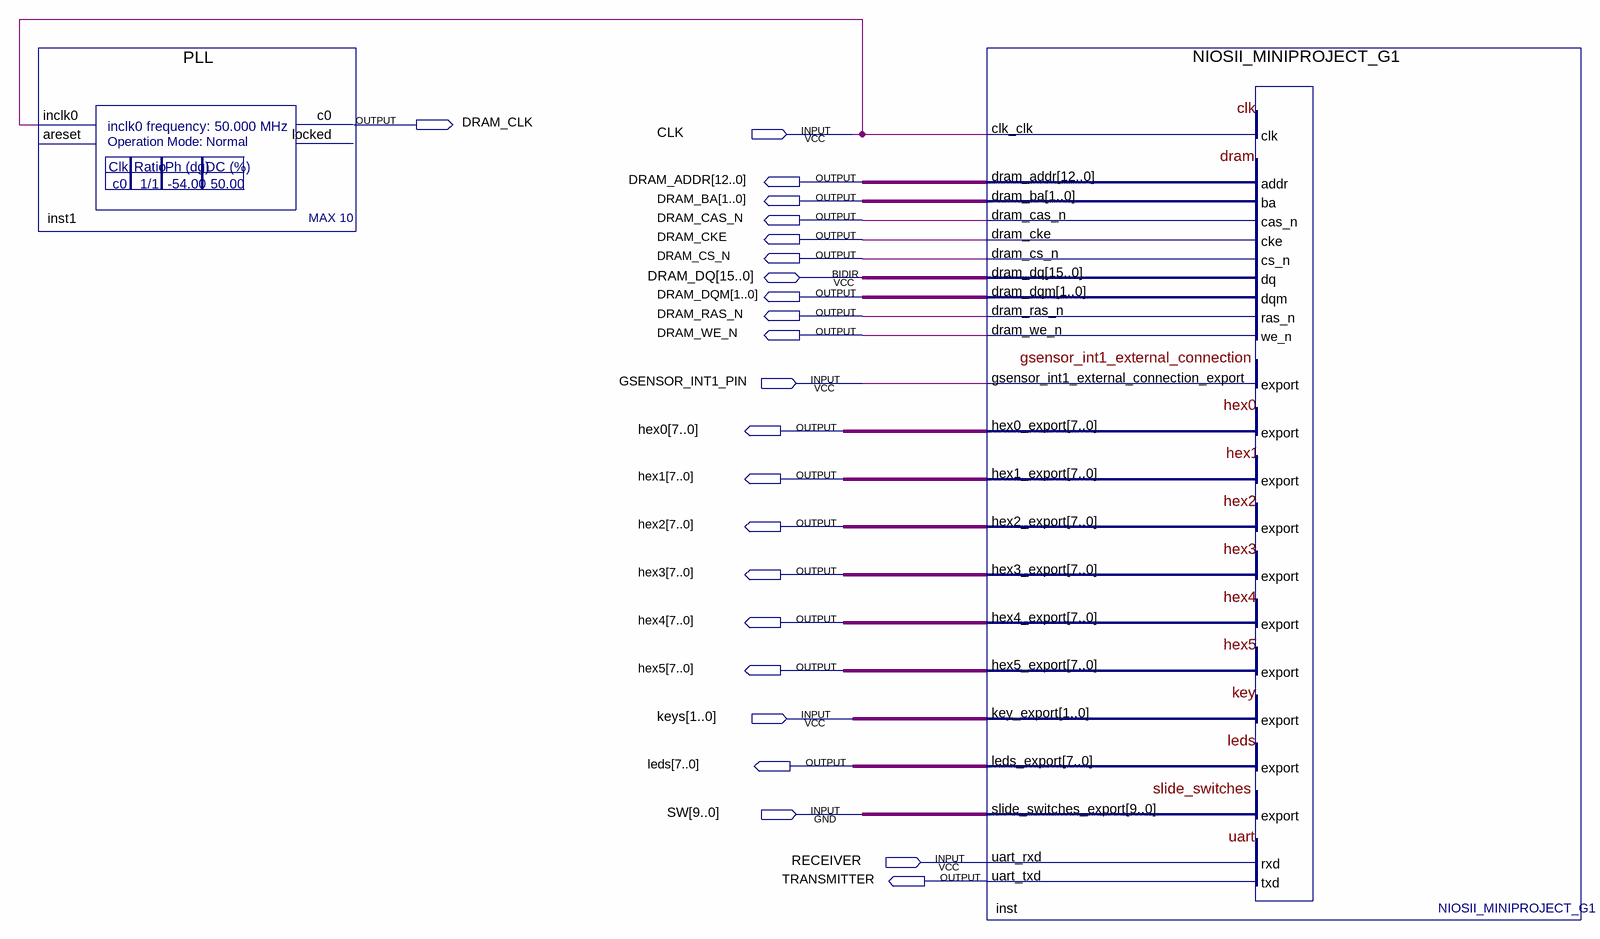
[diagram p0: schematic sheet]
// Quartus schematic ECE3073_MINIPROJECT_GROUP1.bdf as structural Verilog: 2 symbols, 23 pins
module ECE3073_MINIPROJECT_GROUP1 (
  input  CLK,
  input  GSENSOR_INT1_PIN,
  input  [1:0] keys,
  input  [9:0] SW,
  input  RECEIVER,
  inout  [15:0] DRAM_DQ,
  output DRAM_CLK,
  output [12:0] DRAM_ADDR,
  output [1:0] DRAM_BA,
  output DRAM_CAS_N,
  output DRAM_CKE,
  output DRAM_CS_N,
  output [1:0] DRAM_DQM,
  output DRAM_RAS_N,
  output DRAM_WE_N,
  output [7:0] hex0,
  output [7:0] hex1,
  output [7:0] hex2,
  output [7:0] hex3,
  output [7:0] hex4,
  output [7:0] hex5,
  output [7:0] leds,
  output TRANSMITTER
);

  PLL inst1 (.inclk0(CLK), .c0(DRAM_CLK));  // open: areset, locked
  NIOSII_MINIPROJECT_G1 inst (
    .clk_clk(CLK), .gsensor_int1_external_connection_export(GSENSOR_INT1_PIN), .key_export(keys),
    .slide_switches_export(SW), .uart_rxd(RECEIVER), .dram_addr(DRAM_ADDR), .dram_ba(DRAM_BA),
    .dram_cas_n(DRAM_CAS_N), .dram_cke(DRAM_CKE), .dram_cs_n(DRAM_CS_N), .dram_dqm(DRAM_DQM),
    .dram_ras_n(DRAM_RAS_N), .dram_we_n(DRAM_WE_N), .hex0_export(hex0), .hex1_export(hex1),
    .hex2_export(hex2), .hex3_export(hex3), .hex4_export(hex4), .hex5_export(hex5), .leds_export(leds),
    .uart_txd(TRANSMITTER), .dram_dq(DRAM_DQ));
endmodule
